# Altium schematic sheet Input.SchDoc: INPUT
size A4
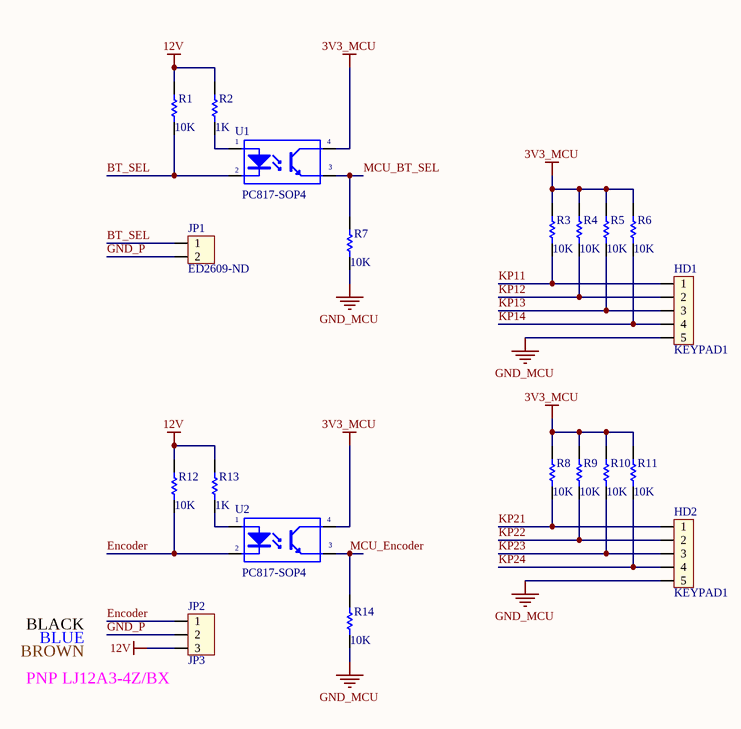
[diagram p0: Input.SchDoc]

## Parts
HD1  KEYPAD1  [CON5]
HD2  KEYPAD1  [CON5]
JP1  ED2609-ND  [2EDGR-5.08-02P]
JP2  JP3  [2EDGR-5.08-03P]
R1  10K  [Res 0805 SMD]
R2  1K  [Res 0805 SMD]
R3  10K  [Res 0805 SMD]
R4  10K  [Res 0805 SMD]
R5  10K  [Res 0805 SMD]
R6  10K  [Res 0805 SMD]
R7  10K  [Res 0805 SMD]
R8  10K  [Res 0805 SMD]
R9  10K  [Res 0805 SMD]
R10  10K  [Res 0805 SMD]
R11  10K  [Res 0805 SMD]
R12  10K  [Res 0805 SMD]
R13  1K  [Res 0805 SMD]
R14  10K  [Res 0805 SMD]
U1  PC817-SOP4  [TPC817-4SOP]
U2  PC817-SOP4  [TPC817-4SOP]

## Nets
3V3_MCU: R3.2 R4.2 R5.2 R6.2 R8.2 R9.2 R10.2 R11.2 U1.4(C) U2.4(C)
12V: JP2.3 R1.2 R2.2 R12.2 R13.2
GND_MCU: HD1.5 HD2.5 R7.1 R14.1
BT_SEL: JP1.1 R1.1 U1.2(K)
Encoder: JP2.1 R12.1 U2.2(K)
GND_P: JP1.2 JP2.2
KP11: HD1.1 R3.1
KP12: HD1.2 R4.1
KP13: HD1.3 R5.1
KP14: HD1.4 R6.1
KP21: HD2.1 R8.1
KP22: HD2.2 R9.1
KP23: HD2.3 R10.1
KP24: HD2.4 R11.1
MCU_BT_SEL: R7.2 U1.3(E)
MCU_Encoder: R14.2 U2.3(E)
NetR2_1: R2.1 U1.1(A)
NetR13_1: R13.1 U2.1(A)

## Notes on the sheet
- BLACK
- BROWN
- (near JP2) PNP LJ12A3-4Z/BX
- BLUE
- Title
- Size:
- Date:
- A4
- Number:
- Time:
- Revision:
- Sheet
- of
- File:

## Library data of the parts
HD1 HD2 = Header5: Header 5; Creat by: VanDungEvn@Gmail.com
JP1 = Con2: 2 Position Wire to Board Terminal Block Horizontal with Board 0.200" (5.08mm) Through Hole; Value: Connector 2; Digikey: ED2609-ND
JP2 = Con3: Connector 3; Value: Connector 3
R1 R12 = 10K/R0603/1%: RES SMD 10K OHM 1% 1/10W 0603; Manufacturer: Yageo; Manufacturer Part Number: RC0603FR-0710KL; Power (Watts): 0.1W, 1/10W; Temperature Coefficient: ±100ppm/°C; Supplier 1: Digi-Key; RoHS: RoHS Compliant; Category: Resistors; Stock 1: 11440000; Pricing 1: 5000=0.00167, 10000=0.00145, 25000=0.00128, 50000=0.00117, 125000=0.00115 (USD); Packaging: Tape & Reel (TR); Resistance (Ohms): 10k; Tolerance: ±1%; Composition: Thick Film; Features: Moisture Resistant; Operating Temperature: -55°C ~ 155°C; Package / Case: 0603 (1608 Metric); Supplier Device Package: 0603; Size / Dimension: 0.063" L x 0.031" W (1.60mm x 0.80mm); Height: 0.022" (0.55mm); Number of Terminations: 2; ComponentLink1URL: http://www.yageo.com/NewPortal/yageodocoutput?fileName=/pdf/R-Chip/PYu-RC_Group_51_RoHS_L_3.pdf; ComponentLink1Description: http://www.yageo.com/NewPortal/yageodocoutput?fileName=/pdf/R-Chip/PYu-RC_Group_51_RoHS_L_3.pdf; Supplier Part Number 1: 311-10.0KHRTR-ND; Buy Link: https://www.thegioiic.com/products?utf8=%E2%9C%93&search=%C4%91i%E1%BB%87n+tr%E1%BB%9F+0805
R2 R13 = 10K/R0603/1%: 1 kOhms ±1% 0.125W, 1/8W Chip Resistor 0805 (2012 Metric) Automotive AEC-Q200 Thick Film; Resistance (Ohms): 10k; Power (Watts): 0.1W, 1/10W; RoHS: RoHS Compliant; Category: Resistors; Features: Moisture Resistant; Operating Temperature: -55°C ~ 155°C; Package / Case: 0603 (1608 Metric); Supplier Device Package: 0603; Size / Dimension: 0.063" L x 0.031" W (1.60mm x 0.80mm); Height: 0.022" (0.55mm); Number of Terminations: 2; ComponentLink1URL: http://www.yageo.com/NewPortal/yageodocoutput?fileName=/pdf/R-Chip/PYu-RC_Group_51_RoHS_L_3.pdf; ComponentLink1Description: http://www.yageo.com/NewPortal/yageodocoutput?fileName=/pdf/R-Chip/PYu-RC_Group_51_RoHS_L_3.pdf; Digikey: 541-1.00KCCT-ND; Buy Link: https://www.thegioiic.com/products?utf8=%E2%9C%93&search=%C4%91i%E1%BB%87n+tr%E1%BB%9F+0805
R3-R11 R14 = 249K/R0805/1%: RES SMD 249K OHM 1% 1/10W 0805; Manufacturer: Yageo; Manufacturer Part Number: RC0603FR-07249KL; Power (Watts): 0.1W, 1/10W; Temperature Coefficient: ±100ppm/°C; Supplier 1: Digi-Key; RoHS: RoHS Compliant; Category: Resistors; Stock 1: 370515; Pricing 1: 1=0.1, 10=0.015, 100=0.006, 1000=0.00268, 2500=0.00233 (USD); Packaging: Cut Tape (CT); Part Status: Active; Tolerance: ±1%; Composition: Thick Film; Features: Moisture Resistant; Operating Temperature: -55°C ~ 155°C; Package / Case: 0603 (1608 Metric); Supplier Device Package: 0603; Size / Dimension: 0.063" L x 0.032" W (1.60mm x 0.80mm); Height - Seated (Max): 0.022" (0.55mm); Failure Rate: -; ComponentLink1URL: http://www.yageo.com/documents/recent/PYu-RC_Group_51_RoHS_L_8.pdf; ComponentLink1Description: http://www.yageo.com/documents/recent/PYu-RC_Group_51_RoHS_L_8.pdf; Buy Link: https://www.thegioiic.com/products?utf8=%E2%9C%93&search=%C4%91i%E1%BB%87n+tr%E1%BB%9F+0805
U1 U2 = PC817: Optoisolator Transistor Output 5000Vrms 1 Channel 4-SOP; Digikey: TPC817S1BRAGCT-ND; BuyVN: https://banlinhkien.vn/goods-1134-pc817-el817-sop4-opto.html